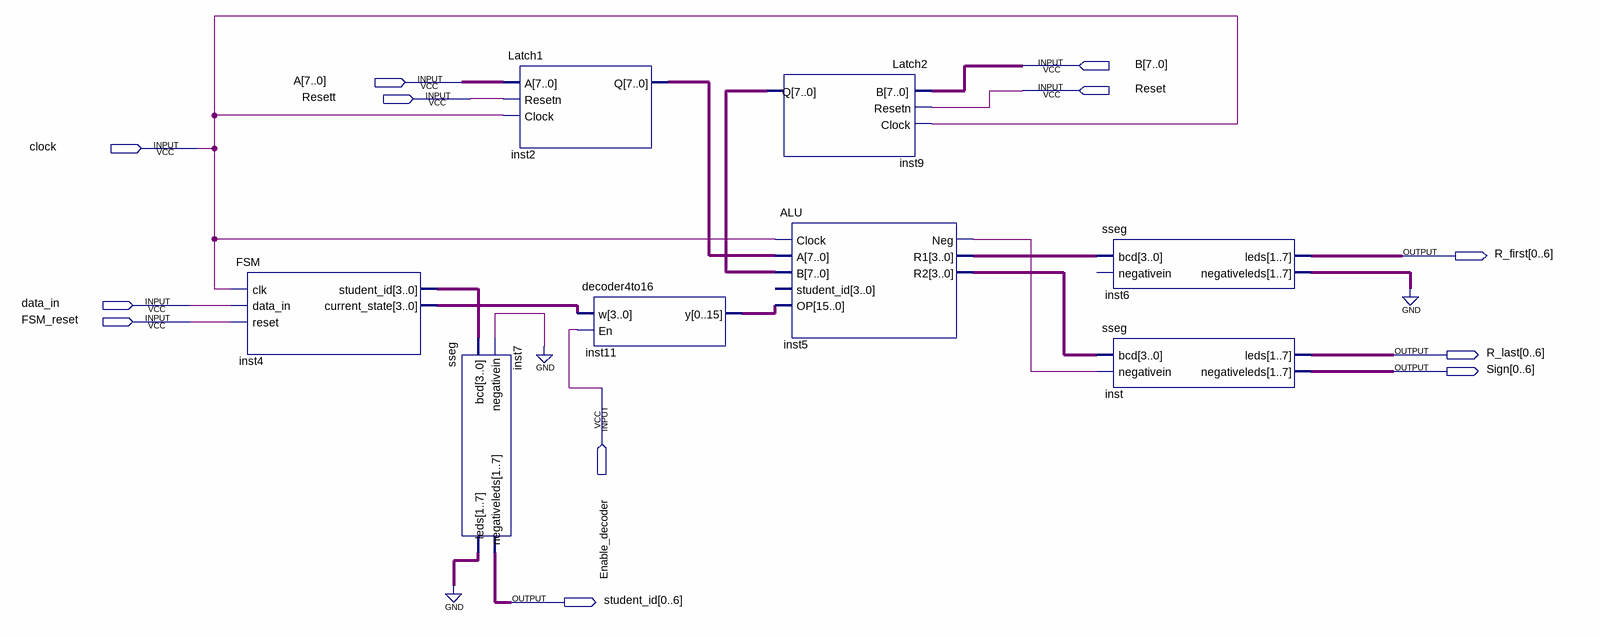
[diagram p0: schematic sheet]
// Quartus schematic lab6one.bdf as structural Verilog: 8 symbols, 12 pins
module lab6one (
  input  [7:0] B,
  input  [7:0] A,
  input  Reset,
  input  Resett,
  input  clock,
  input  data_in,
  input  FSM_reset,
  input  Enable_decoder,
  output [0:6] R_first,
  output [0:6] R_last,
  output [0:6] Sign,
  output [0:6] student_id
);

  wire inst5_neg;
  wire [3:0] inst4_current_state, inst4_student_id, inst5_r1, inst5_r2;
  wire [6:0] inst6_negativeleds, inst7_leds;
  wire [7:0] inst2_q, inst9_q;
  wire [15:0] inst11_y;

  FSM inst4 (
    .clk(clock), .data_in(data_in), .reset(FSM_reset), .student_id(inst4_student_id),
    .current_state(inst4_current_state));
  sseg inst7 (.bcd(inst4_student_id), .negativein(1'b0), .leds(inst7_leds), .negativeleds(student_id));
  Latch1 inst2 (.A(A), .Resetn(Resett), .Clock(clock), .Q(inst2_q));
  decoder4to16 inst11 (.w(inst4_current_state), .En(Enable_decoder), .y(inst11_y));
  Latch2 inst9 (.B(B), .Resetn(Reset), .Clock(clock), .Q(inst9_q));
  ALU inst5 (
    .Clock(clock), .A(inst2_q), .B(inst9_q), .OP(inst11_y), .Neg(inst5_neg), .R1(inst5_r1), .R2(inst5_r2));  // open: student_id
  sseg inst6 (.bcd(inst5_r1), .leds(R_first), .negativeleds(inst6_negativeleds));  // open: negativein
  sseg inst (.bcd(inst5_r2), .negativein(inst5_neg), .leds(R_last), .negativeleds(Sign));
  // also tied to GND on the sheet: {inst7_leds[0], inst7_leds[1], inst7_leds[2], inst7_leds[3], inst7_leds[4], inst7_leds[5], inst7_leds[6], inst6_negativeleds[0], inst6_negativeleds[1], inst6_negativeleds[2], inst6_negativeleds[3], inst6_negativeleds[4], inst6_negativeleds[5], inst6_negativeleds[6]}
endmodule
